# EasyEDA schematic SCH_Boom-Crane-Body_2025-03-01.json
TITLE: Boom Crane Main Schematic; REV: 1.0; Date: 2024-05-15; Sheet: 1/1; Drawn By: aarin.khadpe; Company: Your Company
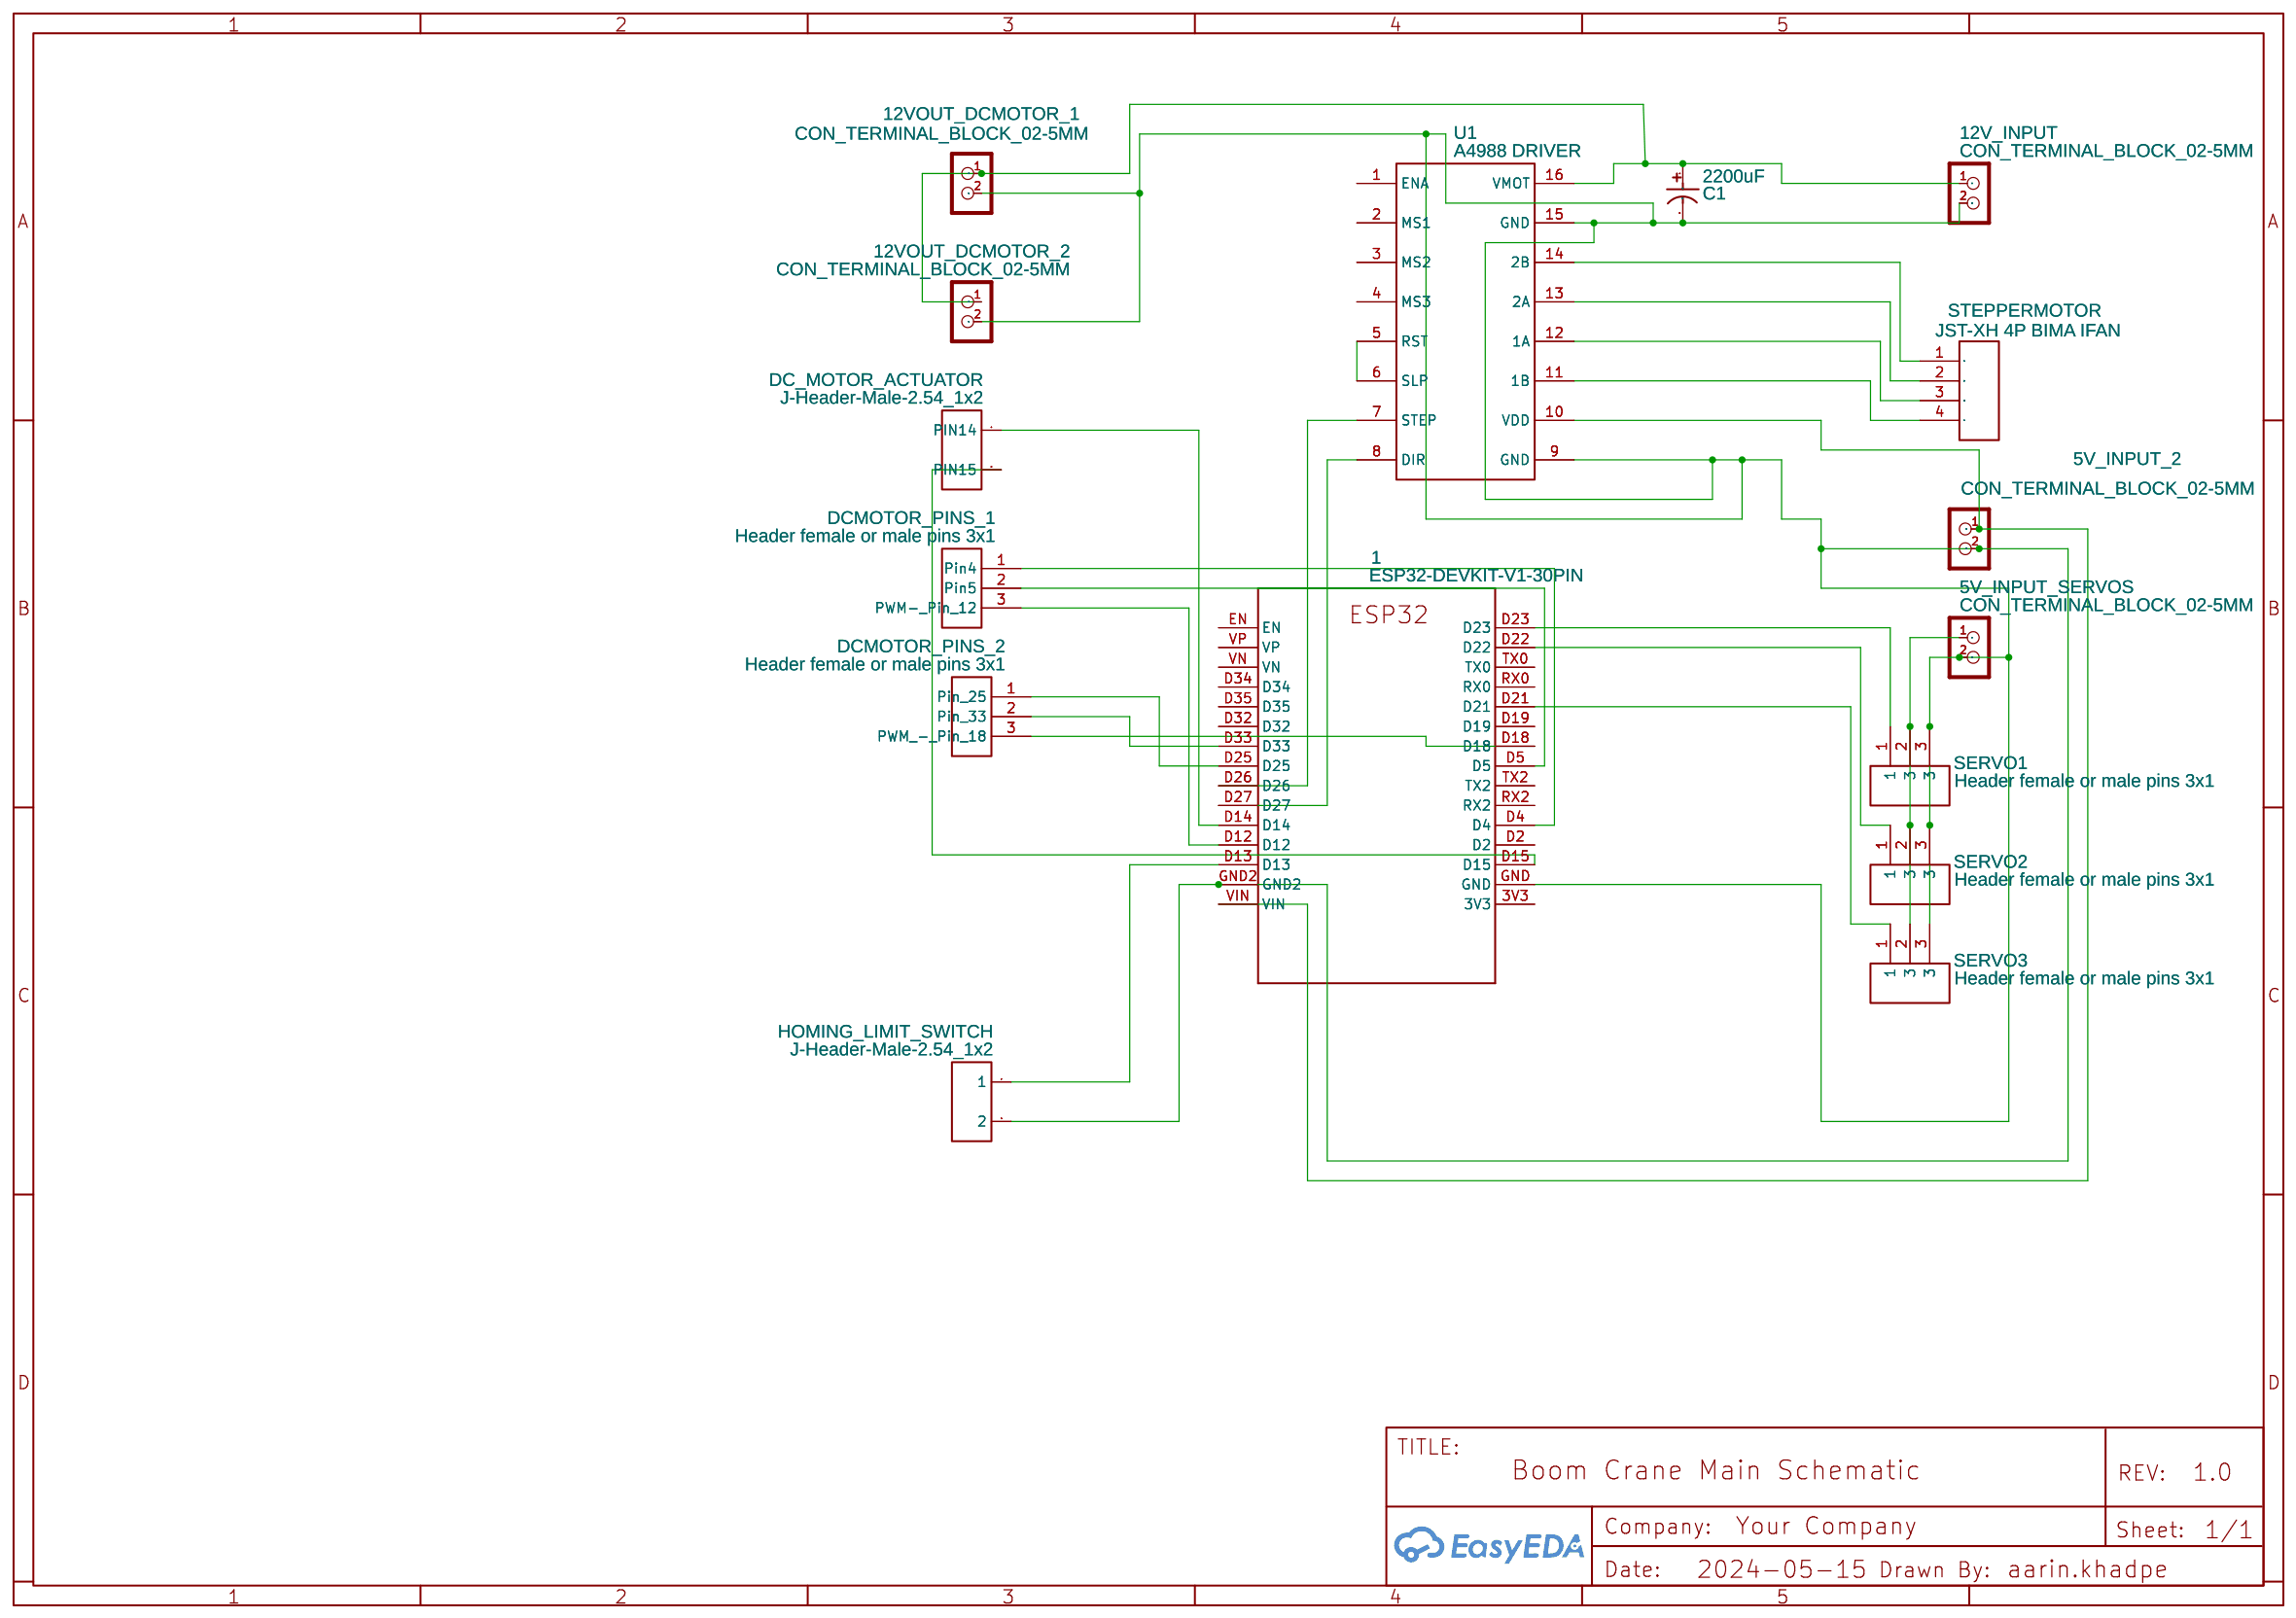
[diagram p0: schematic sheet]

## Parts
1  ESP32-DEVKIT-V1-30PIN  [ESP32-DEVKITV1_ESP32-DEVKITV1-30PINS]
5V_INPUT_2  CON_TERMINAL_BLOCK_02-5MM  [TERMINAL_BLOCK_2P_5]
5V_INPUT_SERVOS  CON_TERMINAL_BLOCK_02-5MM  [TERMINAL_BLOCK_2P_5]
12V_INPUT  CON_TERMINAL_BLOCK_02-5MM  [TERMINAL_BLOCK_2P_5]
12VOUT_DCMOTOR_1  CON_TERMINAL_BLOCK_02-5MM  [TERMINAL_BLOCK_2P_5]
12VOUT_DCMOTOR_2  CON_TERMINAL_BLOCK_02-5MM  [TERMINAL_BLOCK_2P_5]
C1  2200uF  [CAP2200UFX25V-13X20(5MM, D-0.6)]
DC_MOTOR_ACTUATOR  J-Header-Male-2.54_1x2  [HDR-2X1/2.54]
DCMOTOR_PINS_1  Header female or male pins 3x1  [HEADER FEMALE OR MALE PINS 3X1]
DCMOTOR_PINS_2  Header female or male pins 3x1  [HEADER FEMALE OR MALE PINS 3X1]
HOMING_LIMIT_SWITCH  J-Header-Male-2.54_1x2  [HDR-2X1/2.54]
SERVO1  Header female or male pins 3x1  [HEADER FEMALE OR MALE PINS 3X1]
SERVO2  Header female or male pins 3x1  [HEADER FEMALE OR MALE PINS 3X1]
SERVO3  Header female or male pins 3x1  [HEADER FEMALE OR MALE PINS 3X1]
STEPPERMOTOR  JST-XH 4P BIMA IFAN  [4PIN_2.54_MM_JST_XHP_JST_CONNECTOR_FOR_DC_SOCKET]
U1  A4988 DRIVER  [A4988-16P]

## Library data of the parts
1 = ESP32-DEVKIT-V1-30PIN: Contributor: petrawilliamleka
5V_INPUT_2 5V_INPUT_SERVOS 12V_INPUT 12VOUT_DCMOTOR_1 12VOUT_DCMOTOR_2 = CON_TERMINAL_BLOCK_02-5MM: 2 poles wire to board terminal block; Contributor: DangerousPrototype
C1 = 2200uF: Voltage: 25V; Supplier Part: C88760; Supplier: LCSC; Manufacturer: Rubycon; Manufacturer Part: 16ZLH680MEFC8X16
DC_MOTOR_ACTUATOR HOMING_LIMIT_SWITCH = J-Header-Male-2.54_1x2: image: //image.lceda.cn/szlcsc/C86471.jpg; Supplier Part: C86471; Supplier: LCSC; Manufacturer: TE Connectivity; Manufacturer Part: 826629-2
DCMOTOR_PINS_1 DCMOTOR_PINS_2 SERVO1-SERVO3 = Header female or male pins 3x1: Contributor: Guest
STEPPERMOTOR = JST-XH 4P BIMA IFAN: Contributor: moorpcbs
U1 = A4988 DRIVER: Contributor: VnryW0

## Nets
Net-(1-D4): 1.D4 DCMOTOR_PINS_1.1(Pin4)
Net-(1-D5): 1.D5 DCMOTOR_PINS_1.2(Pin5)
Net-(1-D12): 1.D12 DCMOTOR_PINS_1.3(PWM- Pin 12)
Net-(1-D13): 1.D13 HOMING_LIMIT_SWITCH.1
Net-(1-D14): 1.D14 DC_MOTOR_ACTUATOR.1(PIN14)
Net-(1-D15): 1.D15 DC_MOTOR_ACTUATOR.2(PIN15)
Net-(1-D18): 1.D18 DCMOTOR_PINS_2.3(PWM - Pin 18)
Net-(1-D21): 1.D21 SERVO3.1
Net-(1-D22): 1.D22 SERVO2.1
Net-(1-D23): 1.D23 SERVO1.1
Net-(1-D25): 1.D25 DCMOTOR_PINS_2.1(Pin 25)
Net-(1-D26): 1.D26 U1.7(STEP)
Net-(1-D27): 1.D27 U1.8(DIR)
Net-(1-D33): 1.D33 DCMOTOR_PINS_2.2(Pin 33)
Net-(1-GND): 1.GND 1.GND2 5V_INPUT_2.2 5V_INPUT_SERVOS.2 12V_INPUT.2 12VOUT_DCMOTOR_1.2 12VOUT_DCMOTOR_2.2 C1.2 HOMING_LIMIT_SWITCH.2 SERVO1.3 SERVO2.3 SERVO3.3 U1.9(GND) U1.15(GND)
Net-(1-VIN): 1.VIN 5V_INPUT_2.1 U1.10(VDD)
Net-(5V_INPUT_SERVOS-1): 5V_INPUT_SERVOS.1 SERVO1.2(3) SERVO2.2(3) SERVO3.2(3)
Net-(12V_INPUT-1): 12V_INPUT.1 12VOUT_DCMOTOR_1.1 12VOUT_DCMOTOR_2.1 C1.1 U1.16(VMOT)
Net-(STEPPERMOTOR-1): STEPPERMOTOR.1 U1.14(2B)
Net-(STEPPERMOTOR-2): STEPPERMOTOR.2 U1.13(2A)
Net-(STEPPERMOTOR-3): STEPPERMOTOR.3 U1.12(1A)
Net-(STEPPERMOTOR-4): STEPPERMOTOR.4 U1.11(1B)
Net-(U1-5): U1.5(RST) U1.6(SLP)

Not connected (* = marked no-connect by the designer): 1 3V3 D2 D19 D32 D34 D35 EN RX0 RX2 TX0 TX2 VN VP; U1 1(ENA) 2(MS1) 3(MS2) 4(MS3)
